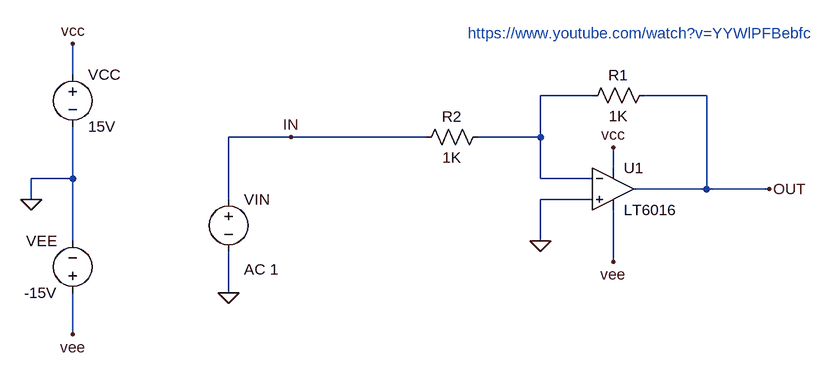
[diagram p0: schematic open_loop_1.asc]
open_loop_1.asc, the LTspice schematic file:
Version 4
SHEET 1 880 680
WIRE -592 96 -592 48
WIRE 208 128 128 128
WIRE 384 128 288 128
WIRE -256 192 -352 192
WIRE -48 192 -256 192
WIRE 128 192 128 128
WIRE 128 192 32 192
WIRE 240 240 240 208
WIRE -592 256 -592 176
WIRE -592 256 -656 256
WIRE 128 256 128 192
WIRE 208 256 128 256
WIRE 384 272 384 128
WIRE 384 272 272 272
WIRE 480 272 384 272
WIRE -656 288 -656 256
WIRE -352 288 -352 192
WIRE 208 288 128 288
WIRE -592 352 -592 256
WIRE 128 352 128 288
WIRE 240 384 240 304
WIRE -352 432 -352 368
WIRE -592 496 -592 432
FLAG 128 352 0
FLAG -352 432 0
FLAG -256 192 IN
FLAG 480 272 OUT
FLAG -656 288 0
FLAG -592 496 vee
FLAG 240 384 vee
FLAG -592 48 vcc
FLAG 240 208 vcc
SYMBOL Opamps\\LT6016 240 272 R0
SYMATTR InstName U1
SYMBOL res 304 112 R90
WINDOW 0 0 56 VBottom 2
WINDOW 3 32 56 VTop 2
SYMATTR InstName R1
SYMATTR Value 1K
SYMBOL res 48 176 R90
WINDOW 0 0 56 VBottom 2
WINDOW 3 32 56 VTop 2
SYMATTR InstName R2
SYMATTR Value 1K
SYMBOL voltage -352 272 R0
WINDOW 123 24 124 Left 2
WINDOW 39 0 0 Left 0
SYMATTR InstName VIN
SYMATTR Value ""
SYMATTR Value2 AC 1
SYMBOL voltage -592 448 R180
WINDOW 0 24 96 Left 2
WINDOW 3 24 16 Left 2
WINDOW 123 0 0 Left 0
WINDOW 39 0 0 Left 0
SYMATTR InstName VEE
SYMATTR Value -15V
SYMBOL voltage -592 80 R0
WINDOW 123 0 0 Left 0
WINDOW 39 0 0 Left 0
SYMATTR InstName VCC
SYMATTR Value 15V
TEXT 16 32 Left 2 ;https://www.youtube.com/watch?v=YYWlPFBebfc

The netlist it stands for:
* open_loop_1.asc
* U1: LT6016 (symbol Opamps\LT6016 not available, pins judged from their places): In+=0 In-=N001 V+=vcc V-=vee OUT=OUT
R1 OUT N001 1K
R2 N001 IN 1K
VIN IN 0 AC 1
VEE vee 0 -15V
VCC vcc 0 15V
* https://www.youtube.com/watch?v=YYWlPFBebfc
.backanno
.end